# EAGLE schematic Big Reds Dash2 (EAGLE 4.13)
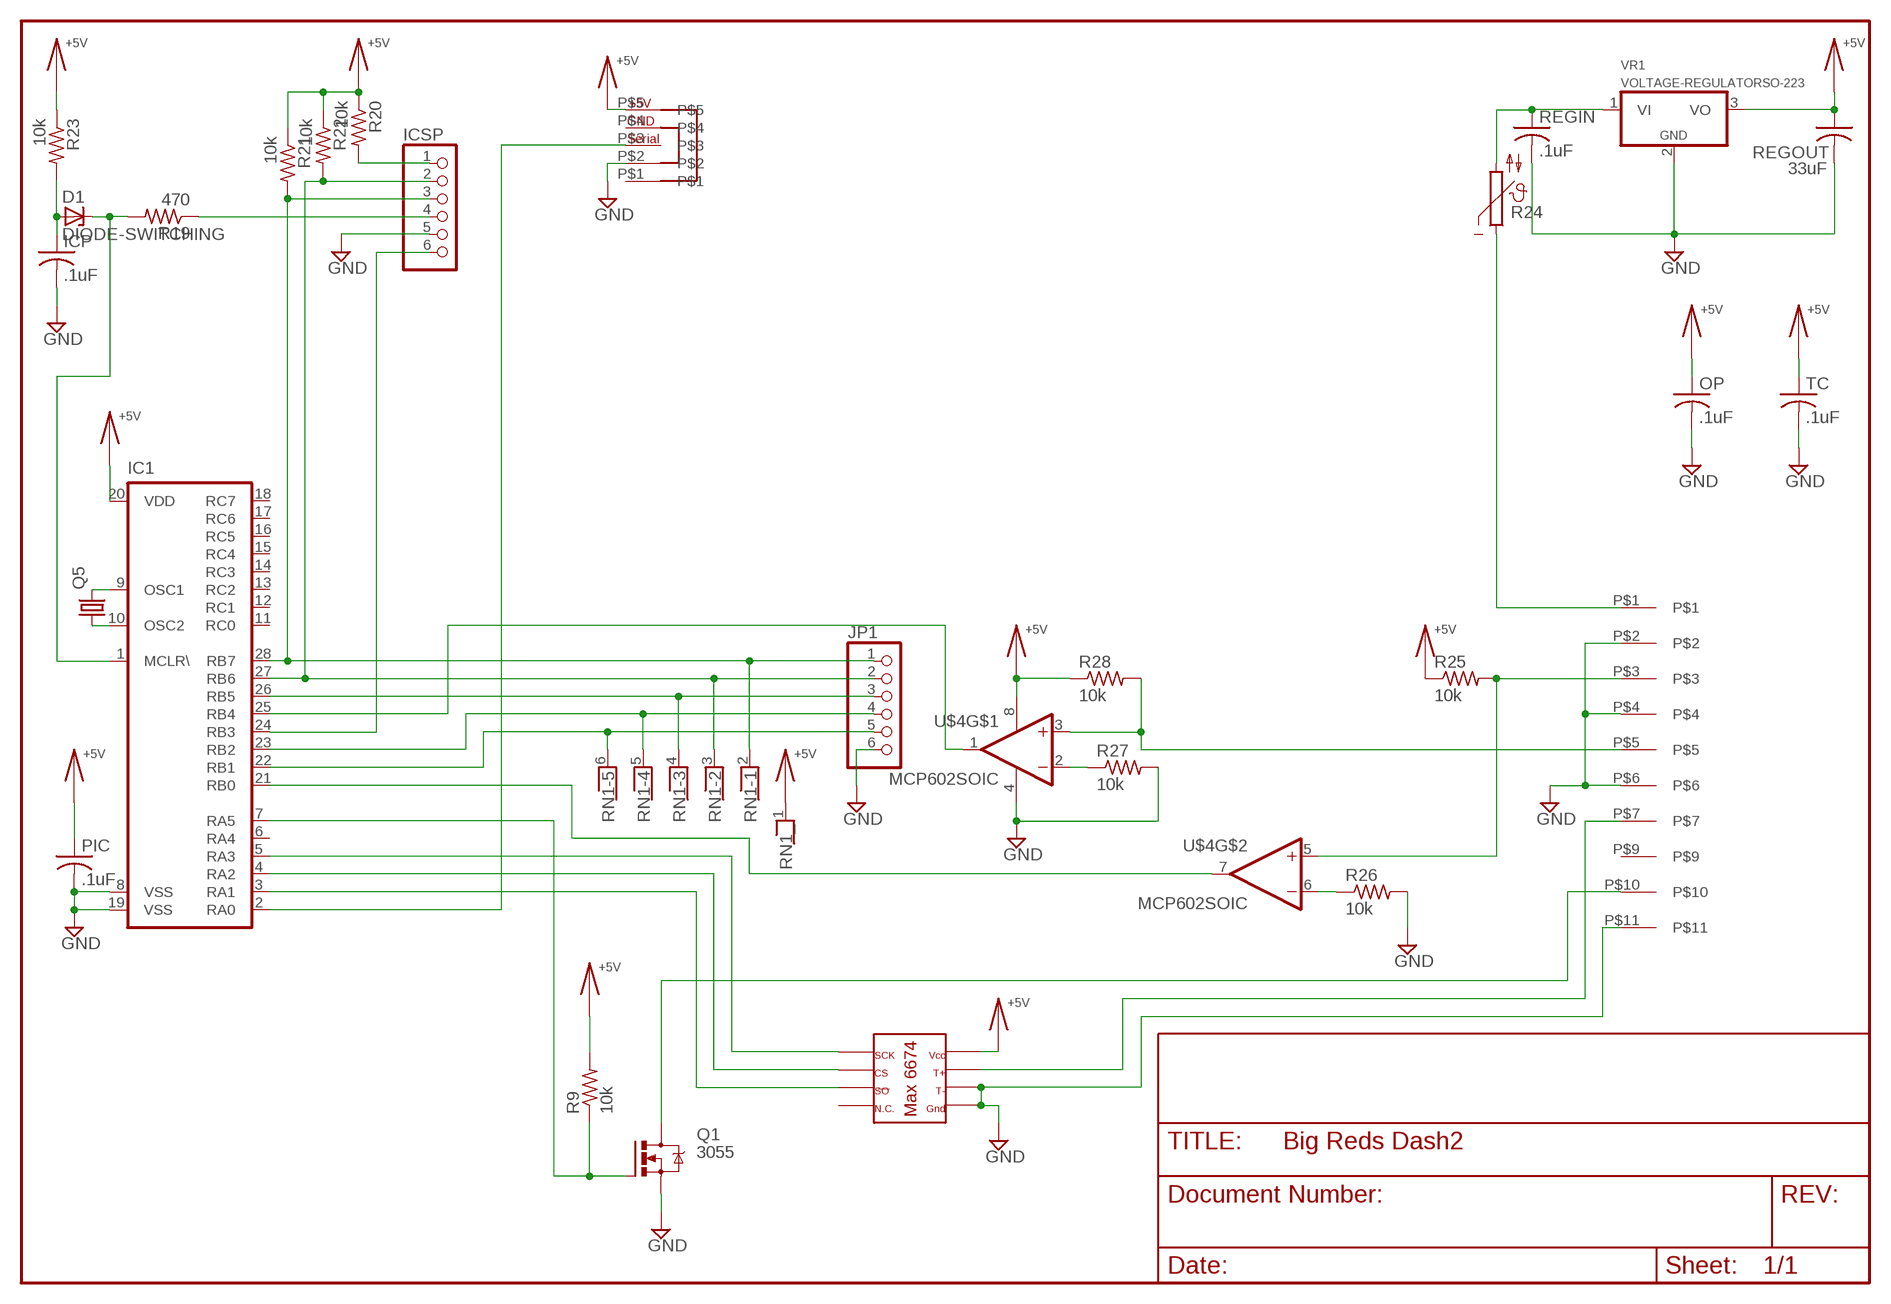
[diagram p0: schematic, sheet 1]

## Parts
D1  DIODE-SWITCHING  [SOT323-W]
IC1  PIC16F73SO  [SO-28W]
ICP  .1uF  CAPACITOR-NO-POLARITYC1210K  [C1210K]
ICSP  PINHD-1X6  [1X06]
JP1  PINHD-1X6  [1X06]
OP  .1uF  CAPACITOR-NO-POLARITYC1210K  [C1210K]
PIC  .1uF  CAPACITOR-NO-POLARITYC1210K  [C1210K]
Q1  3055  MTP3055VSOIC  [SOT223R_INFINEON]
Q5  CRYSTALSM49  [SM49]
R9  10k  RESISITORM1406  [M1406]
R19  470  RESISITORM1406  [M1406]
R20  10k  RESISITORM1406  [M1406]
R21  10k  RESISITORM1406  [M1406]
R22  10k  RESISITORM1406  [M1406]
R23  10k  RESISITORM1406  [M1406]
R24  NTC640-9  [N640]
R25  10k  RESISITORM1406  [M1406]
R26  10k  RESISITORM1406  [M1406]
R27  10k  RESISITORM1406  [M1406]
R28  10k  RESISITORM1406  [M1406]
REGIN  .1uF  CAPACITOR-NO-POLARITYC1210K  [C1210K]
REGOUT  33uF  CAPACITOR-NO-POLARITYC2220K  [C2220K]
RN1  RNX5  [RN-6]
TC  .1uF  CAPACITOR-NO-POLARITYC1210K  [C1210K]
U$1  ROUND1  [ROUND_BIG_RED]
U$2  MAX6674  [SO08]
U$3  SERIAL_DISPLAY  [SERIAL_DISPLAY]
U$4  MCP602SOIC  [SO08]
VR1  VOLTAGE-REGULATORSO-223  [SOT223R_INFINEON]

## Nets
+5V: IC1.20(VDD) OP.1 PIC.1 R9.2 R20.1 R21.1 R22.1 R23.1 R25.1 R28.1 REGOUT.1 RN1.1 TC.1 U$2.4 U$3.P$5 U$4.8(V+) VR1.3(VO)
GND: IC1.8(VSS) IC1.19(VSS) ICP.2 ICSP.5 JP1.6 OP.2 PIC.2 Q1.3(S) R26.2 R27.2 REGIN.2 REGOUT.2 TC.2 U$1.P$2 U$1.P$4 U$1.P$6 U$1.P$11 U$2.1 U$2.2 U$3.P$2 U$4.4(V-) VR1.2(GND)
N$2: IC1.28(RB7) ICSP.3 JP1.1 R21.2 RN1.2
N$3: IC1.21(RB0) U$4.7(OUT)
N$4: IC1.2(RA0) U$3.P$3
N$6: IC1.26(RB5) JP1.3 RN1.4
N$12: IC1.23(RB2) JP1.4 RN1.5
N$19: IC1.4(RA2) U$2.6
N$20: Q1.2(D) U$1.P$10
N$21: IC1.22(RB1) JP1.5 RN1.6
N$23: D1.3(C) IC1.1(MCLR\) R19.2
N$24: R27.1 U$4.2(-IN)
N$25: IC1.7(RA5) Q1.1(G) R9.1
N$27: R24.1 U$1.P$1
N$29: IC1.27(RB6) ICSP.2 JP1.2 R22.2 RN1.3
N$32: IC1.25(RB4) U$4.1(OUT)
N$38: IC1.9(OSC1) Q5.2
N$39: IC1.10(OSC2) Q5.1
N$41: R25.2 U$1.P$3 U$4.5(+IN)
N$43: IC1.5(RA3) U$2.5
N$46: R28.2 U$1.P$5 U$4.3(+IN)
N$48: U$1.P$7 U$2.3
N$52: IC1.3(RA1) U$2.7
N$59: IC1.24(RB3) ICSP.6
N$60: ICSP.1 R20.2
N$61: ICSP.4 R19.1
N$62: D1.1(A) ICP.1 R23.2
N$64: R24.2 REGIN.1 VR1.1(VI)
N$65: R26.1 U$4.6(-IN)
Unconnected: IC1.6(RA4) IC1.11(RC0) IC1.12(RC1) IC1.13(RC2) IC1.14(RC3) IC1.15(RC4) IC1.16(RC5) IC1.17(RC6) IC1.18(RC7) U$1.P$9 U$2.8 U$3.P$1 U$3.P$4

## Library data of the parts
D1 = 1 Dan's Common Parts:DIODE-SWITCHING: Z DIODE
IC1 = 1 Dan's Common Parts:PIC16F73: MICROCONTROLLER EPROM/ROM-based
ICP OP PIC REGIN REGOUT TC = 1 Dan's Common Parts:CAPACITOR-NO-POLARITY: CAPACITOR, American symbol
ICSP JP1 = pinhead:PINHD-1X6: PIN HEADER
Q1 = 1 Dan's Common Parts:MTP3055V: N-CHANNEL MOS FET
Q5 = 1 Dan's Common Parts:CRYSTAL: CRYSTAL
R9 R19-R23 R25-R28 = 1 Dan's Common Parts:RESISITOR: RESISTOR, American symbol
R24 = ptc-ntc:NTC640-9: PHILIPS NTC
RN1 = resistor-net:RNX5: RESISTOR NETWORK
U$1 = 1 Dan's Common Parts:ROUND1
U$2 = 1 Dan's Common Parts:MAX6674
U$3 = 1 Dan's Common Parts:SERIAL_DISPLAY
U$4 = 1 Dan's Common Parts:MCP602
VR1 = 1 Dan's Common Parts:VOLTAGE-REGULATOR: Positive VOLTAGE REGULATOR Source: http://cache.national.com/ds/LM/LM78L05.pdf http://www.fairchildsemi.com/ds/LM/LM7805.pdf